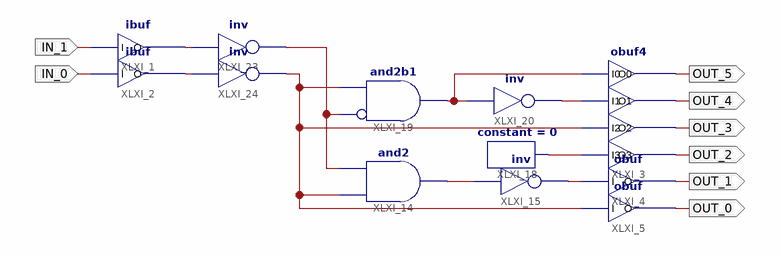
[diagram p0: schematic sheet 1]
// Xilinx ISE schematic Decoder2To6.sch (spartan3a) as structural Verilog: 12 symbols, 8 ports
module Decoder2To6 (
  input  IN_1,
  input  IN_0,
  output OUT_5,
  output OUT_4,
  output OUT_3,
  output OUT_2,
  output OUT_1,
  output OUT_0
);

  wire XLXN_19, XLXN_22, XLXN_23, XLXN_27, XLXN_30, XLXN_99, XLXN_101, XLXN_110, XLXN_111;

  and XLXI_14 (XLXN_22, XLXN_27, XLXN_19);
  and XLXI_19 (XLXN_101, ~XLXN_19, XLXN_27);  // and2b1
  obuf4 XLXI_3 (
    .I0(XLXN_101), .I1(XLXN_99), .I2(XLXN_27), .I3(XLXN_30), .O0(OUT_5), .O1(OUT_4), .O2(OUT_3), .O3(OUT_2));
  obuf XLXI_4 (.I(XLXN_23), .O(OUT_1));
  obuf XLXI_5 (.I(XLXN_27), .O(OUT_0));
  not XLXI_15 (XLXN_23, XLXN_22);
  constant #(.CValue("0")) XLXI_18 (.O(XLXN_30));
  not XLXI_20 (XLXN_99, XLXN_101);
  not XLXI_23 (XLXN_19, XLXN_111);
  not XLXI_24 (XLXN_27, XLXN_110);
  ibuf XLXI_1 (.I(IN_1), .O(XLXN_111));
  ibuf XLXI_2 (.I(IN_0), .O(XLXN_110));
endmodule
